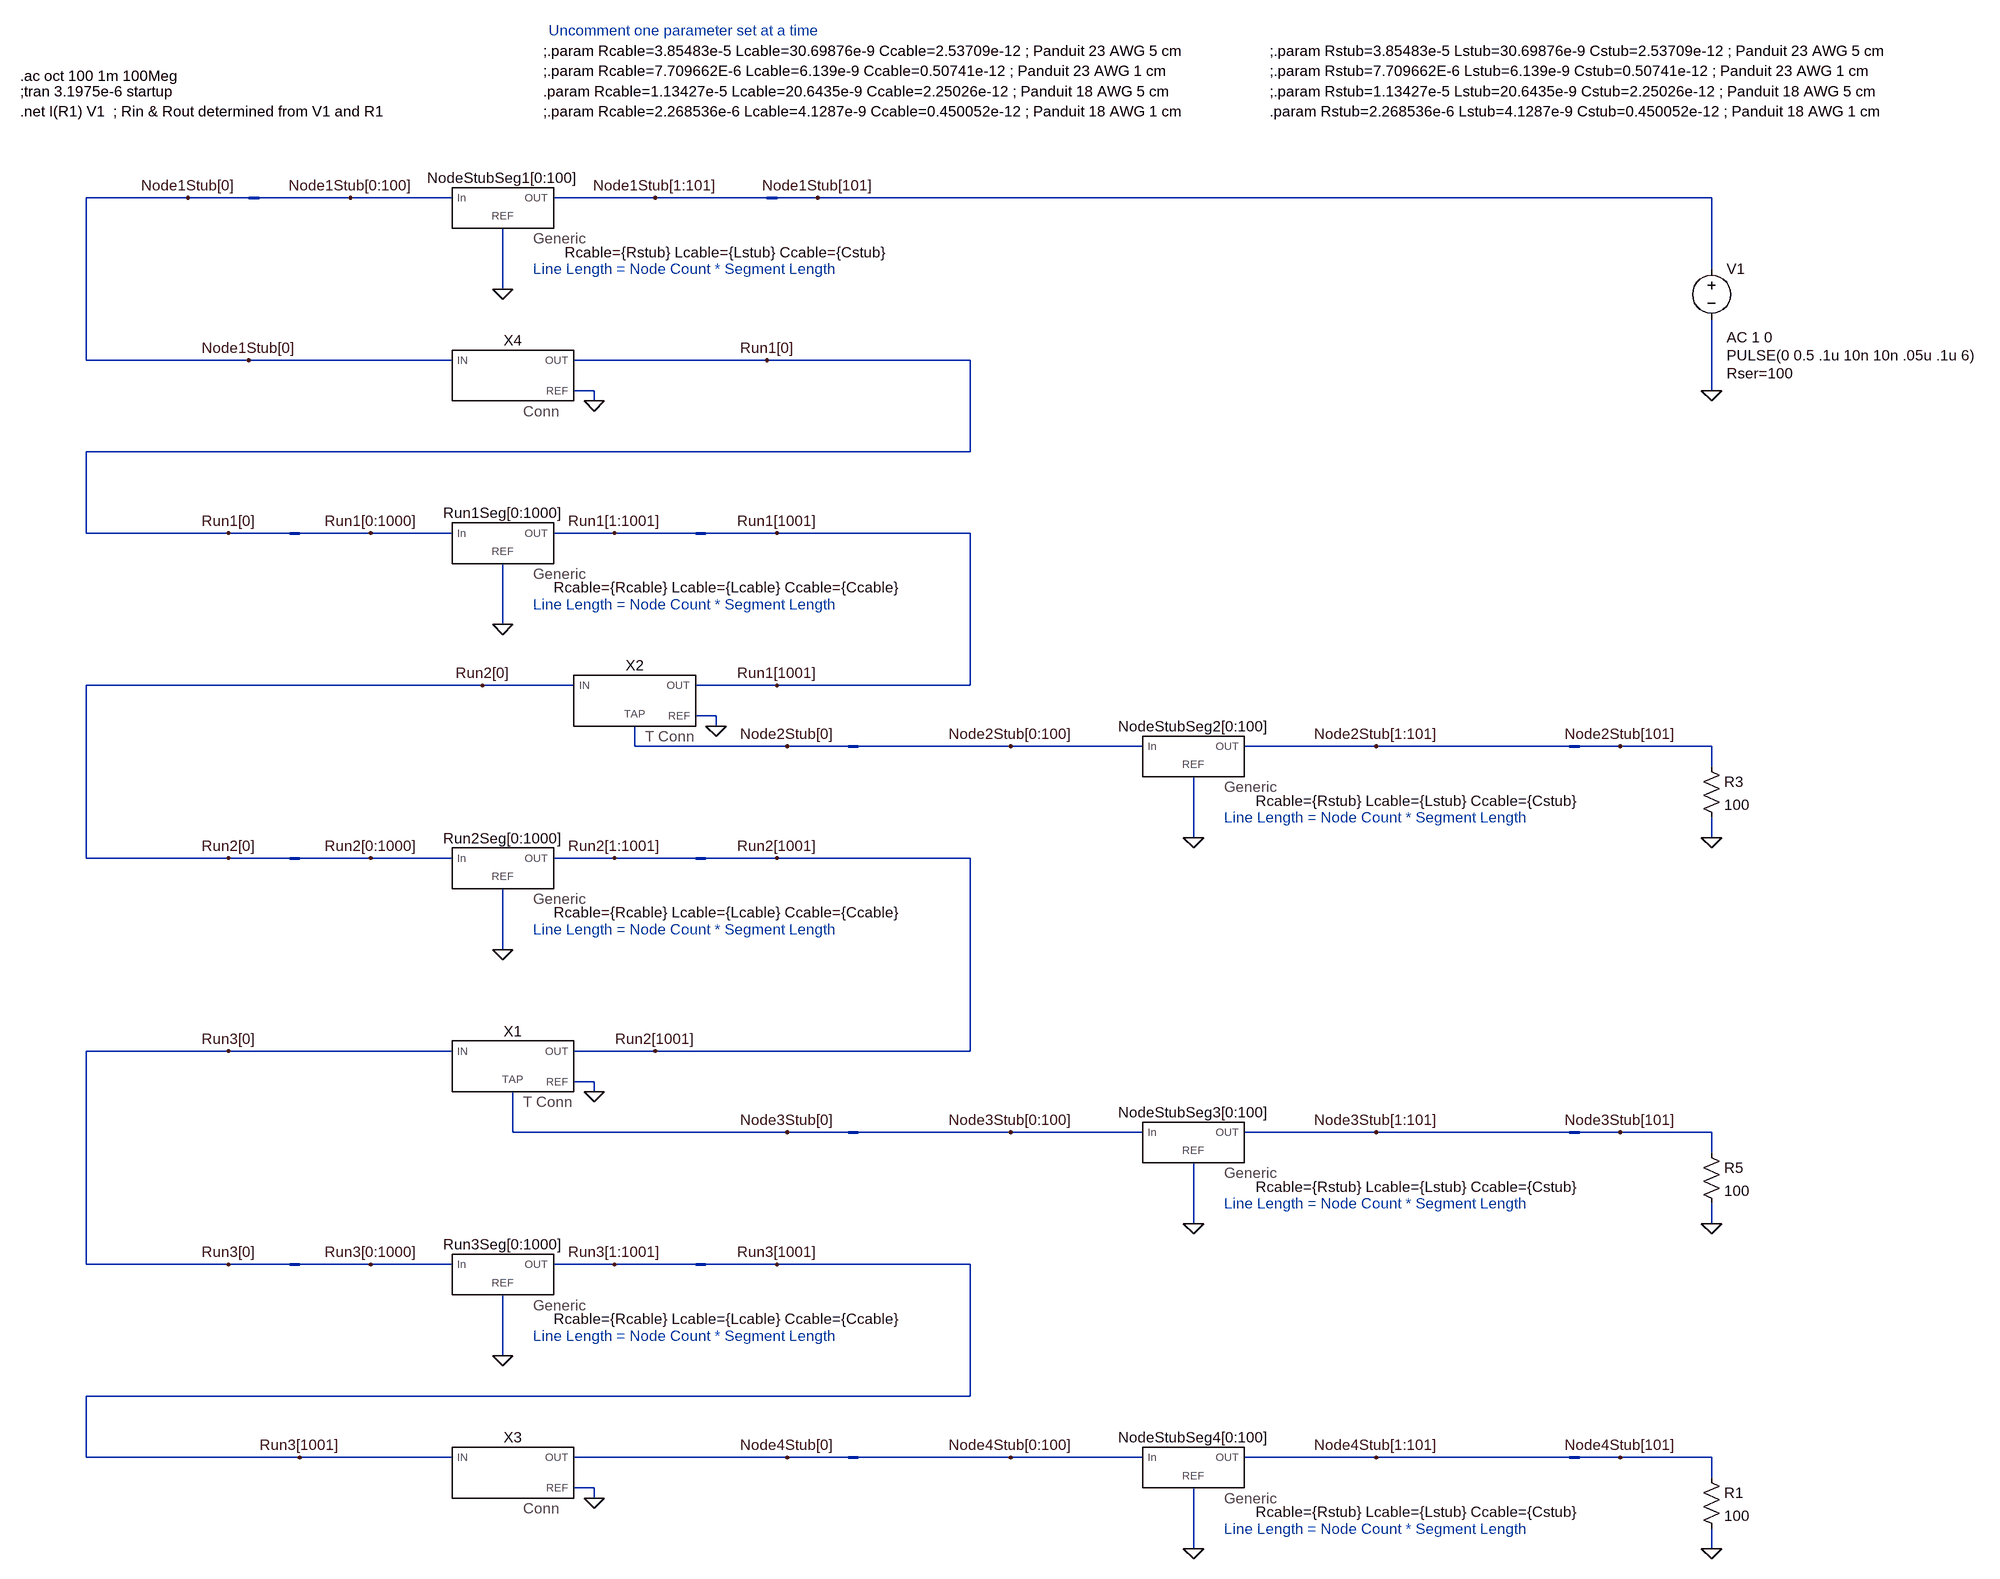
[diagram p0: schematic Basic Topology with Generic Model.asc]
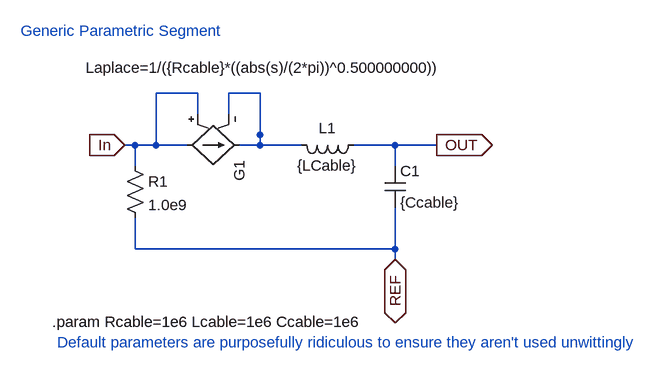
[diagram p1: sub-circuit genericparameterizedmodel.asc]
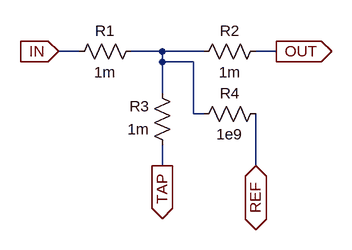
[diagram p2: sub-circuit generictee.asc]
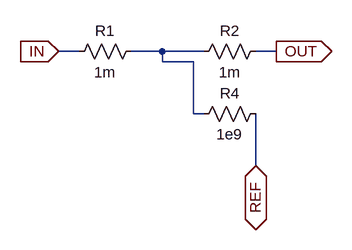
[diagram p3: sub-circuit genericconn.asc]
Basic Topology with Generic Model.asc, the LTspice schematic file:
Version 4
SHEET 1 4724 2388
WIRE 576 240 416 240
WIRE 672 240 576 240
WIRE 832 240 688 240
WIRE 992 240 832 240
WIRE 1312 240 1152 240
WIRE 1488 240 1312 240
WIRE 1568 240 1504 240
WIRE 2976 240 1568 240
WIRE 2976 352 2976 240
WIRE 1072 384 1072 288
WIRE 416 496 416 240
WIRE 672 496 416 496
WIRE 992 496 672 496
WIRE 1488 496 1184 496
WIRE 1808 496 1488 496
WIRE 1216 544 1184 544
WIRE 2976 544 2976 432
WIRE 1216 560 1216 544
WIRE 1808 640 1808 496
WIRE 1808 640 416 640
WIRE 416 768 416 640
WIRE 640 768 416 768
WIRE 736 768 640 768
WIRE 864 768 752 768
WIRE 992 768 864 768
WIRE 1248 768 1152 768
WIRE 1376 768 1248 768
WIRE 1504 768 1392 768
WIRE 1808 768 1504 768
WIRE 1072 912 1072 816
WIRE 1040 1008 416 1008
WIRE 1184 1008 1040 1008
WIRE 1504 1008 1376 1008
WIRE 1808 1008 1808 768
WIRE 1808 1008 1504 1008
WIRE 1408 1056 1376 1056
WIRE 1408 1072 1408 1056
WIRE 1280 1104 1280 1072
WIRE 1520 1104 1280 1104
WIRE 1616 1104 1520 1104
WIRE 1872 1104 1632 1104
WIRE 2080 1104 1872 1104
WIRE 2448 1104 2240 1104
WIRE 2752 1104 2448 1104
WIRE 2832 1104 2768 1104
WIRE 2976 1104 2832 1104
WIRE 2976 1136 2976 1104
WIRE 2160 1248 2160 1152
WIRE 2976 1248 2976 1216
WIRE 416 1280 416 1008
WIRE 640 1280 416 1280
WIRE 736 1280 640 1280
WIRE 864 1280 752 1280
WIRE 992 1280 864 1280
WIRE 1248 1280 1152 1280
WIRE 1376 1280 1248 1280
WIRE 1504 1280 1392 1280
WIRE 1808 1280 1504 1280
WIRE 1072 1424 1072 1328
WIRE 640 1584 416 1584
WIRE 992 1584 640 1584
WIRE 1312 1584 1184 1584
WIRE 1808 1584 1808 1280
WIRE 1808 1584 1312 1584
WIRE 1216 1632 1184 1632
WIRE 1216 1648 1216 1632
WIRE 1088 1712 1088 1648
WIRE 1520 1712 1088 1712
WIRE 1616 1712 1520 1712
WIRE 1872 1712 1632 1712
WIRE 2080 1712 1872 1712
WIRE 2448 1712 2240 1712
WIRE 2752 1712 2448 1712
WIRE 2832 1712 2768 1712
WIRE 2976 1712 2832 1712
WIRE 2976 1744 2976 1712
WIRE 2160 1856 2160 1760
WIRE 2976 1856 2976 1824
WIRE 416 1920 416 1584
WIRE 640 1920 416 1920
WIRE 736 1920 640 1920
WIRE 864 1920 752 1920
WIRE 992 1920 864 1920
WIRE 1248 1920 1152 1920
WIRE 1376 1920 1248 1920
WIRE 1504 1920 1392 1920
WIRE 1808 1920 1504 1920
WIRE 1072 2064 1072 1968
WIRE 1808 2128 1808 1920
WIRE 1808 2128 416 2128
WIRE 416 2224 416 2128
WIRE 752 2224 416 2224
WIRE 992 2224 752 2224
WIRE 1520 2224 1184 2224
WIRE 1616 2224 1520 2224
WIRE 1872 2224 1632 2224
WIRE 2080 2224 1872 2224
WIRE 2448 2224 2240 2224
WIRE 2752 2224 2448 2224
WIRE 2832 2224 2768 2224
WIRE 2976 2224 2832 2224
WIRE 2976 2256 2976 2224
WIRE 1216 2272 1184 2272
WIRE 1216 2288 1216 2272
WIRE 2160 2368 2160 2272
WIRE 2976 2368 2976 2336
FLAG 2976 544 0
FLAG 1072 384 0
FLAG 576 240 Node1Stub[0]
FLAG 1568 240 Node1Stub[101]
FLAG 832 240 Node1Stub[0:100]
FLAG 1312 240 Node1Stub[1:101]
FLAG 2976 1248 0
FLAG 2160 1248 0
FLAG 1520 1104 Node2Stub[0]
FLAG 2832 1104 Node2Stub[101]
FLAG 1872 1104 Node2Stub[0:100]
FLAG 2448 1104 Node2Stub[1:101]
FLAG 2976 1856 0
FLAG 2160 1856 0
FLAG 1520 1712 Node3Stub[0]
FLAG 2832 1712 Node3Stub[101]
FLAG 1872 1712 Node3Stub[0:100]
FLAG 2448 1712 Node3Stub[1:101]
FLAG 2976 2368 0
FLAG 2160 2368 0
FLAG 1520 2224 Node4Stub[0]
FLAG 2832 2224 Node4Stub[101]
FLAG 1872 2224 Node4Stub[0:100]
FLAG 2448 2224 Node4Stub[1:101]
FLAG 1072 912 0
FLAG 640 768 Run1[0]
FLAG 1504 768 Run1[1001]
FLAG 864 768 Run1[0:1000]
FLAG 1248 768 Run1[1:1001]
FLAG 1072 1424 0
FLAG 640 1280 Run2[0]
FLAG 1504 1280 Run2[1001]
FLAG 864 1280 Run2[0:1000]
FLAG 1248 1280 Run2[1:1001]
FLAG 1072 2064 0
FLAG 640 1920 Run3[0]
FLAG 1504 1920 Run3[1001]
FLAG 864 1920 Run3[0:1000]
FLAG 1248 1920 Run3[1:1001]
FLAG 1216 1648 0
FLAG 1408 1072 0
FLAG 1216 2288 0
FLAG 1216 560 0
FLAG 752 2224 Run3[1001]
FLAG 640 1584 Run3[0]
FLAG 1312 1584 Run2[1001]
FLAG 1504 1008 Run1[1001]
FLAG 1040 1008 Run2[0]
FLAG 672 496 Node1Stub[0]
FLAG 1488 496 Run1[0]
BUSTAP 1488 240 1504 240
BUSTAP 672 240 688 240
BUSTAP 2752 1104 2768 1104
BUSTAP 1616 1104 1632 1104
BUSTAP 2752 1712 2768 1712
BUSTAP 1616 1712 1632 1712
BUSTAP 2752 2224 2768 2224
BUSTAP 1616 2224 1632 2224
BUSTAP 1376 768 1392 768
BUSTAP 736 768 752 768
BUSTAP 1376 1280 1392 1280
BUSTAP 736 1280 752 1280
BUSTAP 1376 1920 1392 1920
BUSTAP 736 1920 752 1920
SYMBOL voltage 2976 336 R0
WINDOW 3 24 152 Left 2
WINDOW 123 24 124 Left 2
WINDOW 39 24 180 Left 2
SYMATTR Value PULSE(0 0.5 .1u 10n 10n .05u .1u 6)
SYMATTR Value2 AC 1 0
SYMATTR SpiceLine Rser=100
SYMATTR InstName V1
SYMBOL GenericParameterizedModel 1072 240 R0
WINDOW 39 354 101 Bottom 2
SYMATTR SpiceLine Rcable={Rstub} Lcable={Lstub} Ccable={Cstub}
SYMATTR InstName NodeStubSeg1[0:100]
SYMBOL res 2960 1120 R0
SYMATTR InstName R3
SYMATTR Value 100
SYMBOL GenericParameterizedModel 2160 1104 R0
WINDOW 39 354 101 Bottom 2
SYMATTR SpiceLine Rcable={Rstub} Lcable={Lstub} Ccable={Cstub}
SYMATTR InstName NodeStubSeg2[0:100]
SYMBOL res 2960 1728 R0
SYMATTR InstName R5
SYMATTR Value 100
SYMBOL GenericParameterizedModel 2160 1712 R0
WINDOW 39 354 101 Bottom 2
SYMATTR SpiceLine Rcable={Rstub} Lcable={Lstub} Ccable={Cstub}
SYMATTR InstName NodeStubSeg3[0:100]
SYMBOL res 2960 2240 R0
SYMATTR InstName R1
SYMATTR Value 100
SYMBOL GenericParameterizedModel 2160 2224 R0
WINDOW 39 354 101 Bottom 2
SYMATTR SpiceLine Rcable={Rstub} Lcable={Lstub} Ccable={Cstub}
SYMATTR InstName NodeStubSeg4[0:100]
SYMBOL GenericParameterizedModel 1072 768 R0
WINDOW 39 354 101 Bottom 2
SYMATTR SpiceLine Rcable={Rcable} Lcable={Lcable} Ccable={Ccable}
SYMATTR InstName Run1Seg[0:1000]
SYMBOL GenericParameterizedModel 1072 1280 R0
WINDOW 39 354 101 Bottom 2
SYMATTR SpiceLine Rcable={Rcable} Lcable={Lcable} Ccable={Ccable}
SYMATTR InstName Run2Seg[0:1000]
SYMBOL GenericParameterizedModel 1072 1920 R0
WINDOW 39 354 101 Bottom 2
SYMATTR SpiceLine Rcable={Rcable} Lcable={Lcable} Ccable={Ccable}
SYMATTR InstName Run3Seg[0:1000]
SYMBOL GenericTee 1088 1584 R0
SYMATTR InstName X1
SYMBOL GenericTee 1280 1008 R0
SYMATTR InstName X2
SYMBOL GenericConn 1088 2224 R0
SYMATTR InstName X3
SYMBOL GenericConn 1088 496 R0
SYMATTR InstName X4
TEXT 312 72 Left 2 !;tran 3.1975e-6 startup
TEXT 312 48 Left 2 !.ac oct 100 1m 100Meg
TEXT 312 104 Left 2 !.net I(R1) V1  ; Rin & Rout determined from V1 and R1
TEXT 1136 104 Left 2 !;.param Rcable=2.268536e-6 Lcable=4.1287e-9 Ccable=0.450052e-12 ; Panduit 18 AWG 1 cm
TEXT 1136 72 Left 2 !.param Rcable=1.13427e-5 Lcable=20.6435e-9 Ccable=2.25026e-12 ; Panduit 18 AWG 5 cm
TEXT 1136 40 Left 2 !;.param Rcable=7.709662E-6 Lcable=6.139e-9 Ccable=0.50741e-12 ; Panduit 23 AWG 1 cm
TEXT 1136 8 Left 2 !;.param Rcable=3.85483e-5 Lcable=30.69876e-9 Ccable=2.53709e-12 ; Panduit 23 AWG 5 cm
TEXT 1144 -24 Left 2 ;Uncomment one parameter set at a time
TEXT 1120 352 Left 2 ;Line Length = Node Count * Segment Length
TEXT 2208 1216 Left 2 ;Line Length = Node Count * Segment Length
TEXT 2208 1824 Left 2 ;Line Length = Node Count * Segment Length
TEXT 2208 2336 Left 2 ;Line Length = Node Count * Segment Length
TEXT 1120 880 Left 2 ;Line Length = Node Count * Segment Length
TEXT 1120 1392 Left 2 ;Line Length = Node Count * Segment Length
TEXT 1120 2032 Left 2 ;Line Length = Node Count * Segment Length
TEXT 2280 104 Left 2 !.param Rstub=2.268536e-6 Lstub=4.1287e-9 Cstub=0.450052e-12 ; Panduit 18 AWG 1 cm
TEXT 2280 72 Left 2 !;.param Rstub=1.13427e-5 Lstub=20.6435e-9 Cstub=2.25026e-12 ; Panduit 18 AWG 5 cm
TEXT 2280 40 Left 2 !;.param Rstub=7.709662E-6 Lstub=6.139e-9 Cstub=0.50741e-12 ; Panduit 23 AWG 1 cm
TEXT 2280 8 Left 2 !;.param Rstub=3.85483e-5 Lstub=30.69876e-9 Cstub=2.53709e-12 ; Panduit 23 AWG 5 cm

genericparameterizedmodel.asc, the sub-circuit schematic file:
Version 4
SHEET 1 880 704
WIRE -96 -64 -160 -64
WIRE 0 -64 -48 -64
WIRE -96 -32 -96 -64
WIRE -48 -32 -48 -64
WIRE -192 16 -208 16
WIRE -160 16 -160 -64
WIRE -160 16 -192 16
WIRE -112 16 -160 16
WIRE 0 16 0 -64
WIRE 0 16 -32 16
WIRE 64 16 0 16
WIRE 208 16 144 16
WIRE 272 16 208 16
WIRE -192 48 -192 16
WIRE 208 48 208 16
WIRE -192 176 -192 128
WIRE 208 176 208 112
WIRE 208 176 -192 176
WIRE 208 192 208 176
WIRE 0 0 0 0
FLAG -208 16 In
IOPIN -208 16 In
FLAG 272 16 OUT
IOPIN 272 16 Out
FLAG 208 192 REF
IOPIN 208 192 BiDir
SYMBOL ind 160 0 R90
WINDOW 0 5 56 VBottom 2
WINDOW 3 32 56 VTop 2
SYMATTR InstName L1
SYMATTR Value {LCable}
SYMBOL cap 192 48 R0
SYMATTR InstName C1
SYMATTR Value {Ccable}
SYMBOL g2 -16 16 R90
WINDOW 3 -119 -302 VRight 2
SYMATTR Value Laplace=1/({Rcable}*((abs(s)/(2*pi))^0.500000000))
SYMATTR InstName G1
SYMBOL res -208 32 R0
SYMATTR InstName R1
SYMATTR Value 1.0e9
TEXT -368 -160 Left 2 ;Generic Parametric Segment
TEXT -320 288 Left 2 !.param Rcable=1e6 Lcable=1e6 Ccable=1e6
TEXT -312 320 Left 2 ;Default parameters are purposefully ridiculous to ensure they aren't used unwittingly

generictee.asc, the sub-circuit schematic file:
Version 4
SHEET 1 880 680
WIRE 64 144 32 144
WIRE 192 144 144 144
WIRE 256 144 192 144
WIRE 368 144 336 144
WIRE 192 160 192 144
WIRE 240 160 192 160
WIRE 192 208 192 160
WIRE 240 240 240 160
WIRE 256 240 240 240
WIRE 192 320 192 288
WIRE 336 320 336 240
FLAG 32 144 IN
IOPIN 32 144 In
FLAG 368 144 OUT
IOPIN 368 144 Out
FLAG 192 320 TAP
IOPIN 192 320 Out
FLAG 336 320 REF
IOPIN 336 320 BiDir
SYMBOL res 160 128 R90
WINDOW 0 0 56 VBottom 2
WINDOW 3 32 56 VTop 2
SYMATTR InstName R1
SYMATTR Value 1m
SYMBOL res 352 128 R90
WINDOW 0 0 56 VBottom 2
WINDOW 3 32 56 VTop 2
SYMATTR InstName R2
SYMATTR Value 1m
SYMBOL res 208 304 R180
WINDOW 0 36 76 Left 2
WINDOW 3 36 40 Left 2
SYMATTR InstName R3
SYMATTR Value 1m
SYMBOL res 352 224 R90
WINDOW 0 0 56 VBottom 2
WINDOW 3 32 56 VTop 2
SYMATTR InstName R4
SYMATTR Value 1e9

genericconn.asc, the sub-circuit schematic file:
Version 4
SHEET 1 880 680
WIRE 64 144 32 144
WIRE 192 144 144 144
WIRE 256 144 192 144
WIRE 368 144 336 144
WIRE 192 160 192 144
WIRE 240 160 192 160
WIRE 240 240 240 160
WIRE 256 240 240 240
WIRE 336 320 336 240
FLAG 32 144 IN
IOPIN 32 144 In
FLAG 368 144 OUT
IOPIN 368 144 Out
FLAG 336 320 REF
IOPIN 336 320 BiDir
SYMBOL res 160 128 R90
WINDOW 0 0 56 VBottom 2
WINDOW 3 32 56 VTop 2
SYMATTR InstName R1
SYMATTR Value 1m
SYMBOL res 352 128 R90
WINDOW 0 0 56 VBottom 2
WINDOW 3 32 56 VTop 2
SYMATTR InstName R2
SYMATTR Value 1m
SYMBOL res 352 224 R90
WINDOW 0 0 56 VBottom 2
WINDOW 3 32 56 VTop 2
SYMATTR InstName R4
SYMATTR Value 1e9

The netlist it stands for:
* Basic Topology with Generic Model.asc
V1 Node1Stub[101] 0 PULSE(0 0.5 .1u 10n 10n .05u .1u 6) AC 1 0 Rser=100
XNodeStubSeg1[0:100] Node1Stub[0:100] Node1Stub[1:101] 0 genericparameterizedmodel params: Rcable={Rstub} Lcable={Lstub} Ccable={Cstub}
R3 Node2Stub[101] 0 100
XNodeStubSeg2[0:100] Node2Stub[0:100] Node2Stub[1:101] 0 genericparameterizedmodel params: Rcable={Rstub} Lcable={Lstub} Ccable={Cstub}
R5 Node3Stub[101] 0 100
XNodeStubSeg3[0:100] Node3Stub[0:100] Node3Stub[1:101] 0 genericparameterizedmodel params: Rcable={Rstub} Lcable={Lstub} Ccable={Cstub}
R1 Node4Stub[101] 0 100
XNodeStubSeg4[0:100] Node4Stub[0:100] Node4Stub[1:101] 0 genericparameterizedmodel params: Rcable={Rstub} Lcable={Lstub} Ccable={Cstub}
XRun1Seg[0:1000] Run1[0:1000] Run1[1:1001] 0 genericparameterizedmodel params: Rcable={Rcable} Lcable={Lcable} Ccable={Ccable}
XRun2Seg[0:1000] Run2[0:1000] Run2[1:1001] 0 genericparameterizedmodel params: Rcable={Rcable} Lcable={Lcable} Ccable={Ccable}
XRun3Seg[0:1000] Run3[0:1000] Run3[1:1001] 0 genericparameterizedmodel params: Rcable={Rcable} Lcable={Lcable} Ccable={Ccable}
XX1 Run3[0] Run2[1001] 0 Node3Stub[0] generictee
XX2 Run2[0] Run1[1001] 0 Node2Stub[0] generictee
XX3 Run3[1001] Node4Stub[0] 0 genericconn
XX4 Node1Stub[0] Run1[0] 0 genericconn

* block symbol definitions
.subckt genericparameterizedmodel In OUT REF
L1 OUT N001 {LCable}
C1 OUT REF {Ccable}
G1 In N001 In N001 Laplace=1/({Rcable}*((abs(s)/(2*pi))^0.500000000))
R1 In REF 1.0e9
* Generic Parametric Segment
.param Rcable=1e6 Lcable=1e6 Ccable=1e6
* Default parameters are purposefully ridiculous to ensure they aren't used unwittingly
.ends genericparameterizedmodel

.subckt generictee IN OUT REF TAP
R1 N001 IN 1m
R2 OUT N001 1m
R3 TAP N001 1m
R4 REF N001 1e9
.ends generictee

.subckt genericconn IN OUT REF
R1 N001 IN 1m
R2 OUT N001 1m
R4 REF N001 1e9
.ends genericconn

;tran 3.1975e-6 startup
.ac oct 100 1m 100Meg
.net I(R1) V1  ; Rin & Rout determined from V1 and R1
;.param Rcable=2.268536e-6 Lcable=4.1287e-9 Ccable=0.450052e-12 ; Panduit 18 AWG 1 cm
.param Rcable=1.13427e-5 Lcable=20.6435e-9 Ccable=2.25026e-12 ; Panduit 18 AWG 5 cm
;.param Rcable=7.709662E-6 Lcable=6.139e-9 Ccable=0.50741e-12 ; Panduit 23 AWG 1 cm
;.param Rcable=3.85483e-5 Lcable=30.69876e-9 Ccable=2.53709e-12 ; Panduit 23 AWG 5 cm
* Uncomment one parameter set at a time
* Line Length = Node Count * Segment Length
* Line Length = Node Count * Segment Length
* Line Length = Node Count * Segment Length
* Line Length = Node Count * Segment Length
* Line Length = Node Count * Segment Length
* Line Length = Node Count * Segment Length
* Line Length = Node Count * Segment Length
.param Rstub=2.268536e-6 Lstub=4.1287e-9 Cstub=0.450052e-12 ; Panduit 18 AWG 1 cm
;.param Rstub=1.13427e-5 Lstub=20.6435e-9 Cstub=2.25026e-12 ; Panduit 18 AWG 5 cm
;.param Rstub=7.709662E-6 Lstub=6.139e-9 Cstub=0.50741e-12 ; Panduit 23 AWG 1 cm
;.param Rstub=3.85483e-5 Lstub=30.69876e-9 Cstub=2.53709e-12 ; Panduit 23 AWG 5 cm
.backanno
.end